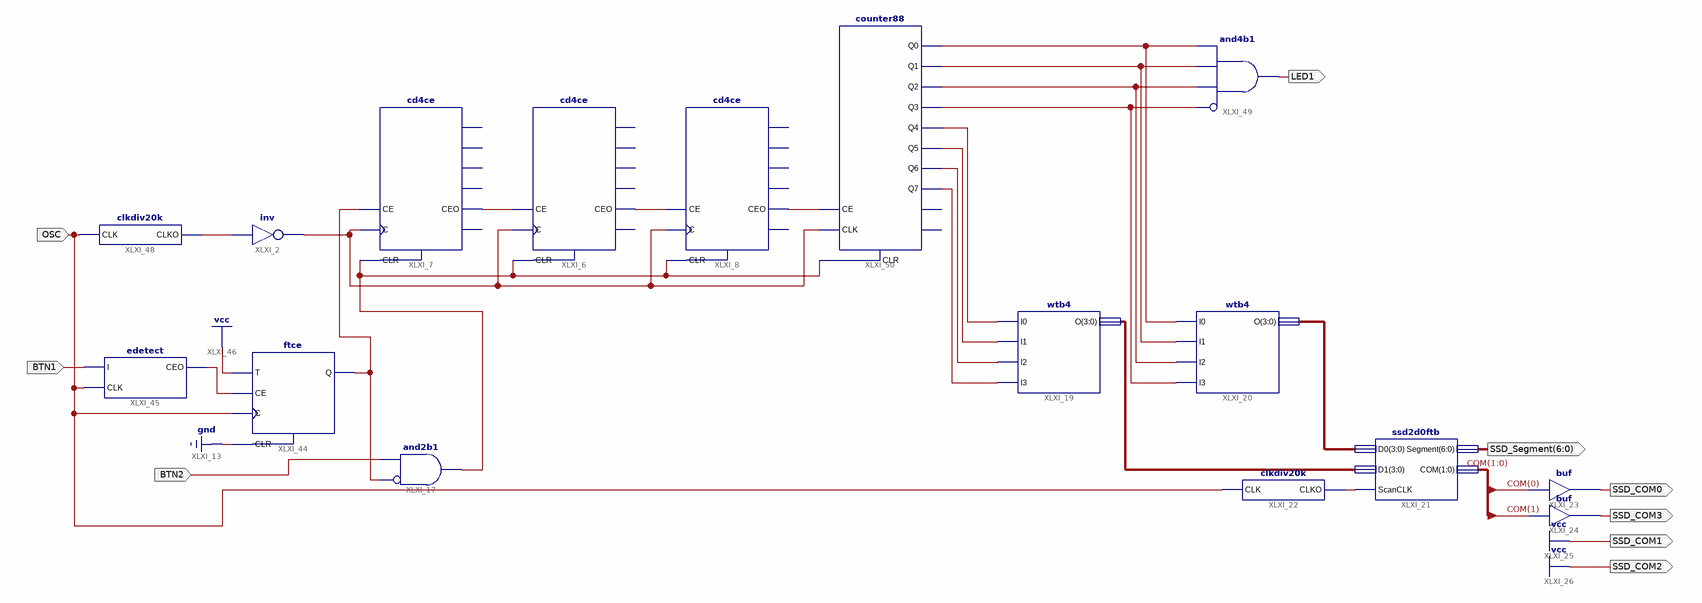
[diagram p0: schematic sheet 1]
// Xilinx ISE schematic main.sch (spartan6) as structural Verilog: 16 symbols, 9 ports
module main (
  input  BTN2,
  input  OSC,
  input  BTN1,
  output [6:0] SSD_Segment,
  output SSD_COM0,
  output SSD_COM3,
  output SSD_COM1,
  output SSD_COM2,
  output LED1
);

  wire XLXN_1, XLXN_5, XLXN_6, XLXN_7, XLXN_13, XLXN_25, XLXN_46, XLXN_89, XLXN_95, XLXN_96, XLXN_97,
       XLXN_98, XLXN_99, XLXN_100, XLXN_101, XLXN_102, XLXN_104;
  wire [1:0] COM;
  wire [3:0] XLXN_45, XLXN_92;

  not XLXI_2 (XLXN_89, XLXN_1);
  cd4ce XLXI_6 (.C(XLXN_89), .CE(XLXN_5), .CLR(XLXN_13), .CEO(XLXN_6));  // open: Q0, Q1, Q2, Q3, TC
  cd4ce XLXI_7 (.C(XLXN_89), .CE(XLXN_25), .CLR(XLXN_13), .CEO(XLXN_5));  // open: Q0, Q1, Q2, Q3, TC
  cd4ce XLXI_8 (.C(XLXN_89), .CE(XLXN_6), .CLR(XLXN_13), .CEO(XLXN_7));  // open: Q0, Q1, Q2, Q3, TC
  and XLXI_17 (XLXN_13, ~XLXN_25, BTN2);  // and2b1
  wtb4 XLXI_19 (.I0(XLXN_99), .I1(XLXN_100), .I2(XLXN_101), .I3(XLXN_102), .O(XLXN_92));
  wtb4 XLXI_20 (.I0(XLXN_95), .I1(XLXN_96), .I2(XLXN_97), .I3(XLXN_98), .O(XLXN_45));
  ssd2d0ftb XLXI_21 (.COM(COM), .D0(XLXN_45), .D1(XLXN_92), .ScanCLK(XLXN_46), .Segment(SSD_Segment));
  clkdiv20k XLXI_22 (.CLK(OSC), .CLKO(XLXN_46));
  buf XLXI_23 (SSD_COM0, COM[0]);
  buf XLXI_24 (SSD_COM3, COM[1]);
  ftce XLXI_44 (.C(OSC), .CE(XLXN_104), .CLR(1'b0), .T(1'b1), .Q(XLXN_25));
  edetect XLXI_45 (.CEO(XLXN_104), .CLK(OSC), .I(BTN1));
  clkdiv20k XLXI_48 (.CLK(OSC), .CLKO(XLXN_1));
  and XLXI_49 (LED1, ~XLXN_98, XLXN_97, XLXN_96, XLXN_95);  // and4b1
  counter88 XLXI_50 (
    .CE(XLXN_7), .CLK(XLXN_89), .CLR(XLXN_13), .Q0(XLXN_95), .Q1(XLXN_96), .Q2(XLXN_97), .Q3(XLXN_98),
    .Q4(XLXN_99), .Q5(XLXN_100), .Q6(XLXN_101), .Q7(XLXN_102));  // open: CEO, TC

  assign SSD_COM1 = 1'b1;
  assign SSD_COM2 = 1'b1;
endmodule
